# Altium project 2230_TubePitotDeporte_v1.0.0.PrjPcb
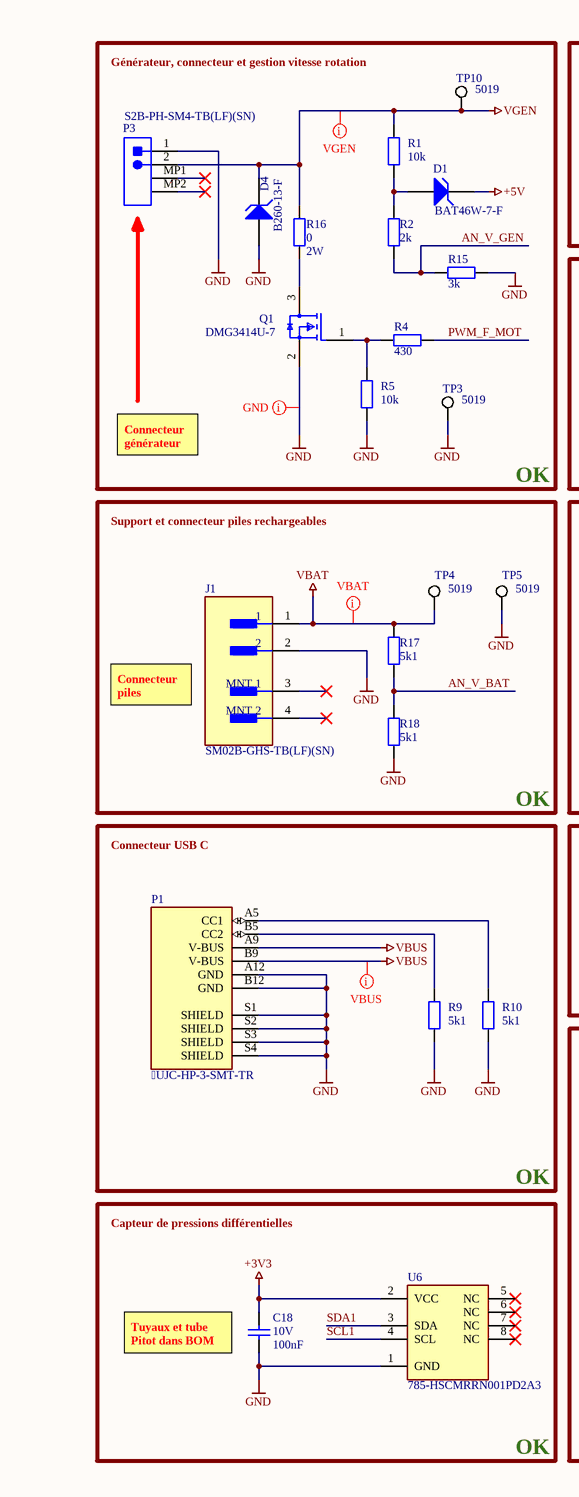
[diagram p0: 2230_TubePitotDeporte_Schematic_v1.0.0.SchDoc, left]
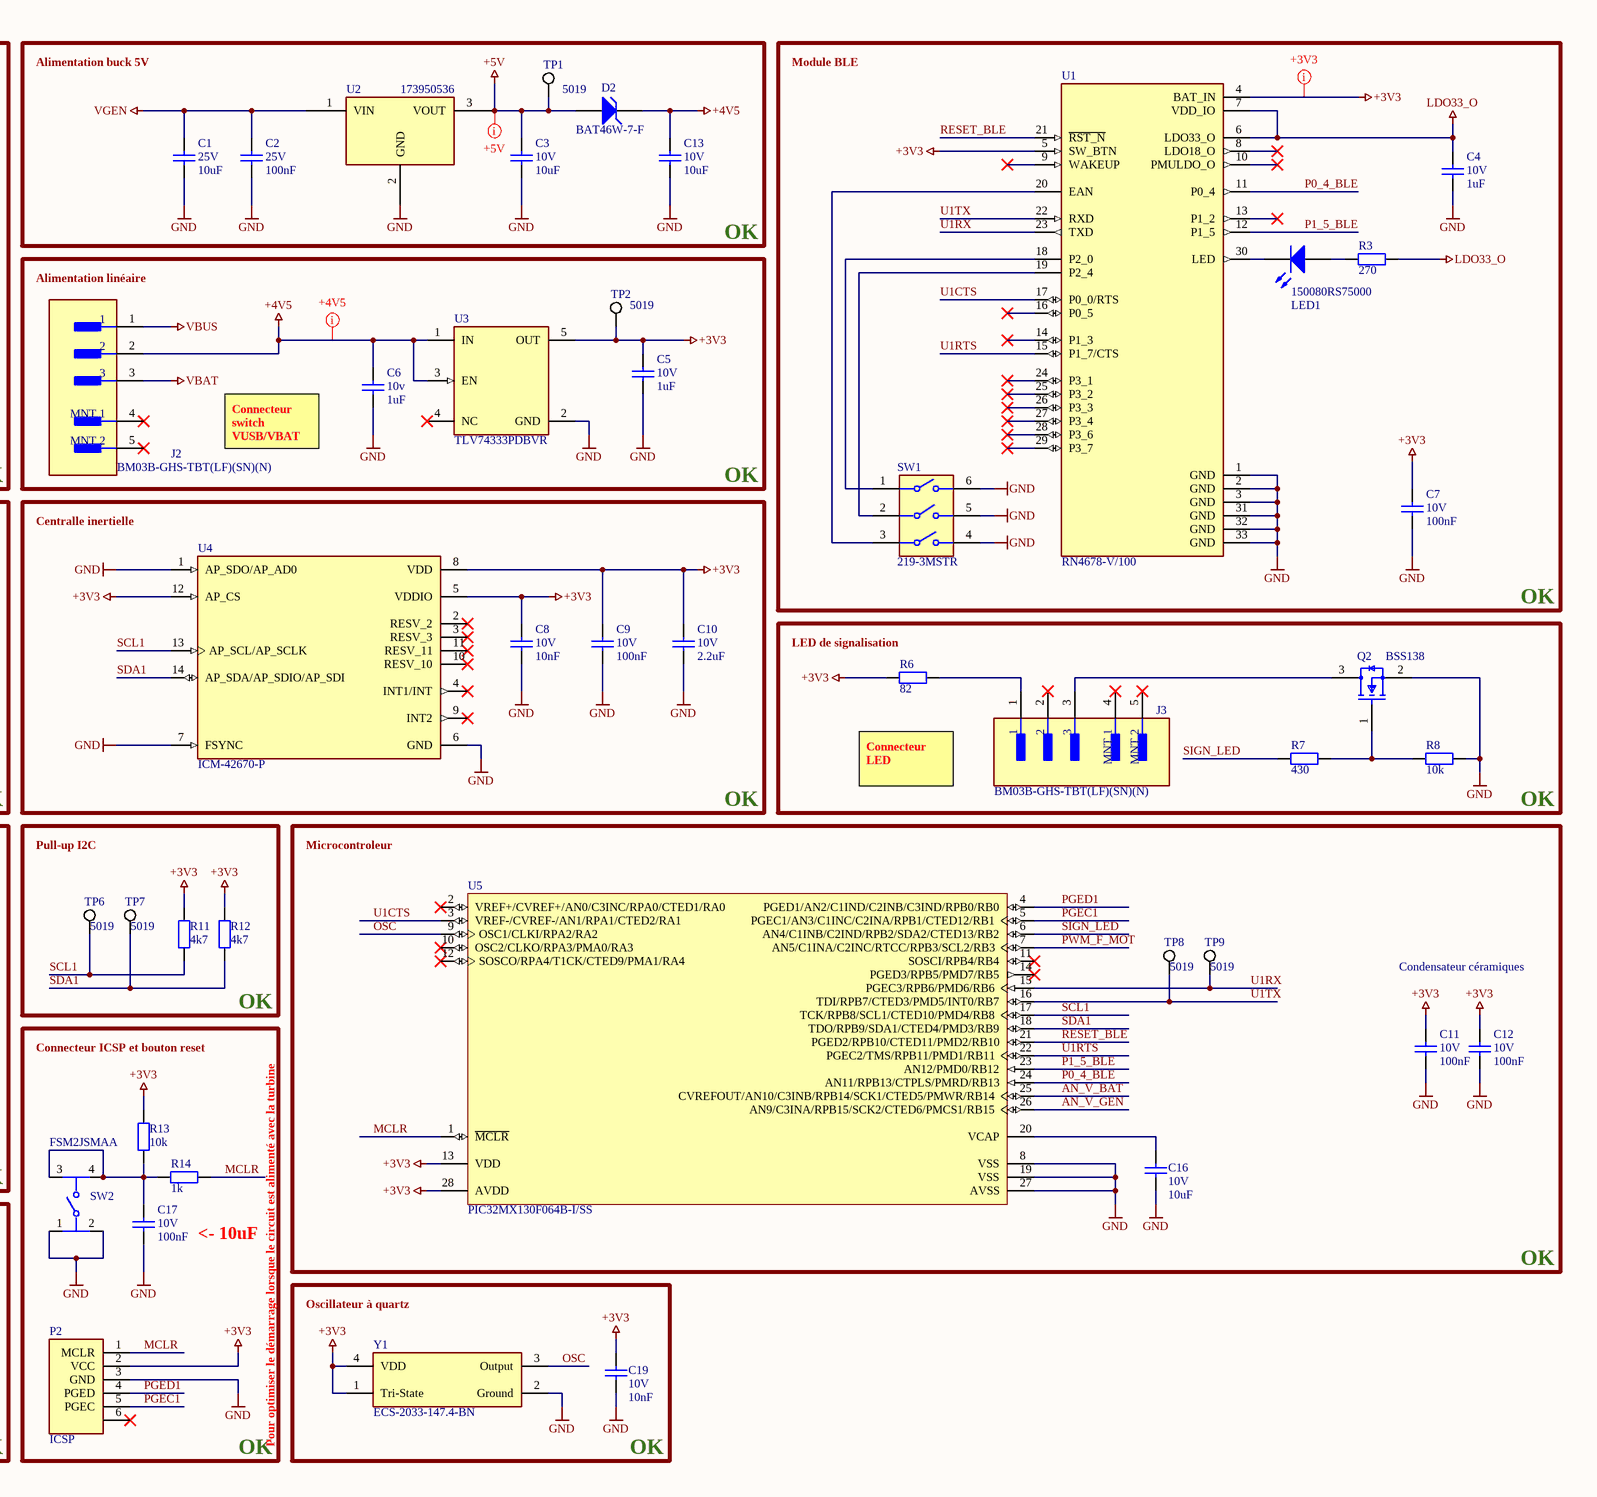
[diagram p1: 2230_TubePitotDeporte_Schematic_v1.0.0.SchDoc, right]
1 sheet, 66 parts. Net scope: global (net labels, ports and power ports of the same name join across sheets).
Board file: 2230_TubePitotDeporte_PCB_v1.0.0.PcbDoc

## Sheet 2230_TubePitotDeporte_Schematic_v1.0.0.SchDoc
size A3; Organization: ETML-ES; Address1: Avenue Recordon 1; Address2: 1004 Lausanne; Address3: Switzerland; SheetNumber: 1; SheetTotal: 1; SPICEModelCacheXRYLVPHF: <root> / <DocumentId>XRYLVPHF</DocumentId> / <CacheFrame Number="0"> / <Model Name="zener" Kind="MDL"> / <Text>*ZENER / *Default Zener 10V @ 10mA / *Zener Diode Pinout: A,K / .MODEL ZENER D( BV=10 IBV=10E-3 )</Text> / </Model> / </CacheFrame> / </root>

### Parts
C1  25V  value 10uF  [0805 CAP T0.95]
C2  25V  value 100nF  [0805 CAP T0.75]
C3  10V  value 10uF  [0805 CAP T0.95]
C4  10V  value 1uF  [0805 CAP T0.75]
C5  10V  value 1uF  [0805 CAP T0.95]
C6  10v  value 1uF  [0805 CAP T0.95]
C7  10V  value 100nF  [0805 CAP T0.75]
C8  10V  value 10nF  [0805 CAP T0.75]
C9  10V  value 100nF  [0805 CAP T0.75]
C10  10V  value 2.2uF  [0805 CAP T0.75]
C11  10V  value 100nF  [0805 CAP T0.75]
C12  10V  value 100nF  [0805 CAP T0.75]
C13  10V  value 10uF  [0805 CAP T0.95]
C16  10V  value 10uF  [0805 CAP T0.95]
C17  10V  value 100nF  [0805 CAP T0.75]
C18  10V  value 100nF  [0805 CAP T0.75]
C19  10V  value 10nF  [0805 CAP T0.75]
D1  BAT46W-7-F  [SOD123]
D2  BAT46W-7-F  [SOD123]
D4  B260-13-F  [SMB-2]
J1  SM02B-GHS-TB(LF)(SN)  [FP-SM02B-GHS-TB_LF_SN-MFG]
J2  BM03B-GHS-TBT(LF)(SN)(N)  [FP-BM03B-GHS-TBT_LF_SN-MFG]
J3  BM03B-GHS-TBT(LF)(SN)(N)  [FP-BM03B-GHS-TBT_LF_SN-MFG]
LED1  150080RS75000  [0805_A]
P1  UJC-HP-3-SMT-TR  [UJC-HP-3-SMT-TR]
P2  ICSP  [ICSP]
P3  S2B-PH-SM4-TB(LF)(SN)  [JST- S2B-PH-SM4-TB(LF)(SN)-2_V]
Q1  DMG3414U-7  [FP-SOT23-IPC_B]
Q2  BSS138  [FP-318-08-IPC_A]
R1  10k  [0805 Res]
R2  2k  [0805 Res]
R3  value 270  [0805 Res]  (hidden comment: 270R)
R4  value 430  [0805 Res]  (hidden comment: 430R)
R5  10k  [0805 Res]
R6  value 82  [0805 Res]  (hidden comment: 82R)
R7  value 430  [0805 Res]  (hidden comment: 430R)
R8  10k  [0805 Res]
R9  5k1  [0805 Res]
R10  5k1  [0805 Res]
R11  value 4k7  [0805 Res]  (hidden comment: 10k)
R12  value 4k7  [0805 Res]  (hidden comment: 10k)
R13  10k  [0805 Res]
R14  1k  [0805 Res]
R15  3k  [0805 Res]
R16  value 0  Power: 2W  [RES 2W]  (hidden comment: 0R)
R17  5k1  [0805 Res]
R18  5k1  [0805 Res]
SW1  219-3MSTR  [FP-219-3MSTR-MFG]
SW2  FSM2JSMAA  [FP-FSM2JSMAA-MFG]
TP1  5019  [KSTN-5019_V]
TP2  5019  [KSTN-5019_V]
TP3  5019  [KSTN-5019_V]
TP4  5019  [KSTN-5019_V]
TP5  5019  [KSTN-5019_V]
TP6  5019  [KSTN-5019_V]
TP7  5019  [KSTN-5019_V]
TP8  5019  [KSTN-5019_V]
TP9  5019  [KSTN-5019_V]
TP10  5019  [KSTN-5019_V]
U1  RN4678-V/100  [RN4678-V_RM100]
U2  173950536  [173950536]
U3  TLV74333PDBVR  [FP-DBV0005A-MFG]
U4  ICM-42670-P  [ICM-42670-P]
U5  PIC32MX130F064B-I/SS  [PIC32MX130F064B-I/SS]
U6  785-HSCMRRN001PD2A3  [HSCMRRN001PD2A3]
Y1  ECS-2033-147.4-BN  [ECS-2033-147.4-BN]

### Blocks framed on the sheet
OK: D1 D4 P3 Q1 R1 R2 R4 R5 R15 R16 TP3 TP10
OK: C1-C3 C13 D2 TP1 U2
OK: C4 C7 LED1 R3 SW1 U1
OK: C5 C6 J2 TP2 U3
OK: C8-C10 U4
OK: R11 R12 TP6 TP7
OK: C17 P2 R13 R14 SW2
OK: C19 Y1

### Nets
+3V3: C5.2 C7.2 C8.2 C9.2 C10.2 C11.2 C12.2 C18.2 C19.1 P2.2(VCC) R6.1 R11.1 R12.1 R13.1 TP2.1 U1.4(BAT_IN) U1.5(SW_BTN) U3.5(OUT) U4.5(VDDIO) U4.8(VDD) U4.12(AP_CS) U5.13(VDD) U5.28(AVDD) U6.2(VCC) Y1.1(Tri-State) Y1.4(VDD)
+4V5: C6.2 C13.2 D2.2(K) J2.2 U3.1(IN) U3.3(EN)
+5V: C3.2 D1.2(K) D2.1(A) TP1.1 U2.3(VOUT)
GND: C1.1 C2.1 C3.1 C4.1 C5.1 C6.1 C7.1 C8.1 C9.1 C10.1 C11.1 C12.1 C13.1 C16.1 C17.1 C18.1 C19.2 D4.1(A) J1.2 P1.A12(GND) P1.B12(GND) P1.S1(SHIELD) P1.S2(SHIELD) P1.S3(SHIELD) P1.S4(SHIELD) P2.3(GND) P3.1 Q1.2(S) Q2.2(S) R5.1 R8.2 R9.1 R10.1 R15.1 R18.2 SW1.4 SW1.5 SW1.6 SW2.1 SW2.2 TP3.1 TP5.1 U1.1(GND) U1.2(GND) U1.3(GND) U1.31(GND) U1.32(GND) U1.33(GND) U2.2(GND) U3.2(GND) U4.1(AP_SDO/AP_AD0) U4.6(GND) U4.7(FSYNC) U5.8(VSS) U5.19(VSS) U5.27(AVSS) U6.1(GND) Y1.2(Ground)
LDO33_O: C4.2 R3.1 U1.6(LDO33_O) U1.7(VDD_IO)
VBAT: J1.1 J2.3 R17.1 TP4.1
VBUS: J2.1 P1.A9(V-BUS) P1.B9(V-BUS)
VGEN: C1.2 C2.2 D4.2(K) P3.2 R1.2 R16.2 TP10.1 U2.1(VIN)
AN_V_BAT: R17.2 R18.1 U5.25(CVREFOUT/AN10/C3INB/RPB14/SCK1/CTED5/PMWR/RB14)
AN_V_GEN: R2.2 R15.2 U5.26(AN9/C3INA/RPB15/SCK2/CTED6/PMCS1/RB15)
MCLR: P2.1(MCLR) R14.1 U5.1(~{MCLR})
OSC: U5.9(OSC1/CLKI/RPA2/RA2) Y1.3(Output)
P0_4_BLE: U1.11(P0_4) U5.24(AN11/RPB13/CTPLS/PMRD/RB13)
P1_5_BLE: U1.12(P1_5) U5.23(AN12/PMD0/RB12)
PGEC1: P2.5(PGEC) U5.5(PGEC1/AN3/C1INC/C2INA/RPB1/CTED12/RB1)
PGED1: P2.4(PGED) U5.4(PGED1/AN2/C1IND/C2INB/C3IND/RPB0/RB0)
PWM_F_MOT: R4.1 U5.7(AN5/C1INA/C2INC/RTCC/RPB3/SCL2/RB3)
RESET_BLE: U1.21(~{RST_N}) U5.21(PGED2/RPB10/CTED11/PMD2/RB10)
SCL1: R11.2 TP6.1 U4.13(AP_SCL/AP_SCLK) U5.17(TCK/RPB8/SCL1/CTED10/PMD4/RB8) U6.4(SCL)
SDA1: R12.2 TP7.1 U4.14(AP_SDA/AP_SDIO/AP_SDI) U5.18(TDO/RPB9/SDA1/CTED4/PMD3/RB9) U6.3(SDA)
SIGN_LED: R7.1 U5.6(AN4/C1INB/C2IND/RPB2/SDA2/CTED13/RB2)
U1CTS: U1.17(P0_0/RTS) U5.3(VREF-/CVREF-/AN1/RPA1/CTED2/RA1)
U1RTS: U1.15(P1_7/CTS) U5.22(PGEC2/TMS/RPB11/PMD1/RB11)
U1RX: TP9.1 U1.23(TXD) U5.15(PGEC3/RPB6/PMD6/RB6)
U1TX: TP8.1 U1.22(RXD) U5.16(TDI/RPB7/CTED3/PMD5/INT0/RB7)
NetC16_2: C16.2 U5.20(VCAP)
NetC17_2: C17.2 R13.2 R14.2 SW2.3 SW2.4
NetD1_1: D1.1(A) R1.1 R2.1
NetJ3_1: J3.1 R6.2
NetJ3_3: J3.3 Q2.3(D)
NetLED1_1: LED1.1(K) U1.30(LED)
NetLED1_2: LED1.2(A) R3.2
NetP1_A5: P1.A5(CC1) R10.2
NetP1_B5: P1.B5(CC2) R9.2
NetQ1_1: Q1.1(G) R4.2 R5.2
NetQ1_3: Q1.3(D) R16.1
NetQ2_1: Q2.1(G) R7.2 R8.1
NetSW1_1: SW1.1 U1.18(P2_0)
NetSW1_2: SW1.2 U1.19(P2_4)
NetSW1_3: SW1.3 U1.20(EAN)

Not connected (* = marked no-connect by the designer): J1 3(MNT_1)* 4(MNT_2)*; J2 4(MNT_1)* 5(MNT_2)*; J3 2* 4(MNT_1)* 5(MNT_2)*; P2 6*; P3 MP1* MP2*; U1 8(LDO18_O)* 9(WAKEUP)* 10(PMULDO_O)* 13(P1_2)* 14(P1_3)* 16(P0_5)* 24(P3_1)* 25(P3_2)* 26(P3_3)* 27(P3_4)* 28(P3_6)* 29(P3_7)*; U3 4(NC)*; U4 2(RESV_2)* 3(RESV_3)* 4(INT1/INT)* 9(INT2)* 10(RESV_10)* 11(RESV_11)*; U5 2(VREF+/CVREF+/AN0/C3INC/RPA0/CTED1/RA0)* 10(OSC2/CLKO/RPA3/PMA0/RA3)* 11(SOSCI/RPB4/RB4)* 12(SOSCO/RPA4/T1CK/CTED9/PMA1/RA4)* 14(PGED3/RPB5/PMD7/RB5)*; U6 5(NC)* 6(NC)* 7(NC)* 8(NC)*

### Layout directives
net class PowerLine: +3V3, +4V5, +5V, GND, VBAT, VBUS, VGEN

### Notes on the sheet
- Générateur, connecteur et gestion vitesse rotation
- Alimentation buck 5V
- Module BLE
- (near J2) Alimentation linéaire
- Connecteur générateur
- Connecteur switch VUSB/VBAT
- Support et connecteur piles rechargeables
- Centralle inertielle
- (near R6) LED de signalisation
- Connecteur piles
- Connecteur LED
- Connecteur USB C
- OK
- Pull-up I2C
- Microcontroleur
- Condensateur céramiques
- Connecteur ICSP et bouton reset
- Capteur de pressions différentielles
- <- 10uF
- Oscillateur à quartz
- (near C18) Tuyaux et tube Pitot dans BOM
- Pour optimiser le démarrage lorsque le circuit est alimenté avec la turbine
- Fichier :
- a
- Date :
- Heure :
- Version :
- Auteur :
- Modif.
- b
- c
- d
- Projet :
- No :
- Nb feuilles
- Feuille n°
- Chemin :

### Library data of the parts
C1-C13 C16-C19 = Cap: Capacitor; Published: 8-Jun-2000; LatestRevisionDate: 17-Jul-2002; LatestRevisionNote: Re-released for DXP Platform.; PackageReference: RAD-0.3; Publisher: Altium Limited; PackageDescription: Radial Cap, Thru-Hole; 2 Leads; 0.3 in Pin Spacing
D1 D2 D4 = D Zener: Zener Diode; Published: 8-Jun-2000; LatestRevisionDate: 17-Jul-2002; LatestRevisionNote: Re-released for DXP Platform.; PackageReference: DIODE-0.7; Publisher: Altium Limited; PackageDescription: Diode, Thru-Hole; 2 Leads; 0.7 in Pin Spacing
J1 = CMP-2000-07076-2: CONN HEADER SMD R/A 2POS 1.25MM; Voltage Rating: 50V; Number of Positions: 2; Pitch: 0.049inch; Current Rating: 1A; Connector Type: Outer Shroud Contact; Number of Rows: 1; Contact Material: Bronze; Termination: Solder; Color: Natural; Package Quantity: 2500; Mount: Surface Mount; Housing Color: Natural; Number of Contacts: 2; Packaging: Tape and Reel; Lead Free: Lead Free; Housing Material: Nylon; Orientation: Right Angle; Contact Type: Male Pin; Contact Plating: Tin; Series: GH; Fastening Type: Latch
J2 J3 = CMP-17439-000058-1: CONN HEADER SMD 3POS 1.25MM; Pitch: 0.049inch; Number of Positions: 3; Contact Finish - Mating: TIN; Lead Free: Lead Free; Series: GH; Fastening Type: Ramp; Number of Rows: 1; Insulation Color: Natural; Contact Material: Bronze; Insulation Material: Nylon; Min Operating Temperature: -25°C; Contact Type: Outer Shroud Contact; Max Operating Temperature: 85°C; Termination: Solder; Flammability Rating: UL94 V-0; Color: Natural; Contact Plating: Tin; Contact Shape: Rectangular; Mount: Surface Mount; Packaging: Cut Tape; Connector Type: Header
LED1 = CMP-1426-00011-1: SMD mono-color Chip LED, WL-SMCW, Red; Manufacturer: Wuerth Elektronik; Color: Red; PartNumber: 150080RS75000; PackageReference: 0805_A; ComponentLink2Description: Datasheet; ComponentLink1URL: http://www.we-online.com; ComponentLink1Description: Manufacturer URL; ComponentLink2URL: http://katalog.we-online.com/led/datasheet/150080RS75000.pdf
P1 = UJC-HP-3-SMT-TR: USBC connector
P2 = ICSP: Prog
P3 = CMP-1755-00001-1: Male Header, Pitch 2 mm, 1 x 2 Position, Height 5.5 mm, -25 to 85 degC, RoHS, Tape and Reel; Current Rating: 3 A; ComponentLink1URL: http://www.jst.com/home2.html; Radiation Hardening: No; RoHSCompliant: True; Mount: Through Hole; Contact Material: Bronze; Package Quantity: 100; Width: 2.34 mm; DatasheetVersion: Dec-12; Height: 8.13 mm; Max Operating Temperature: 105degC; ComponentLink2Description: Datasheet; Lead Pitch: 0.1 inch; Contact Finish: Lead; Packaging: Bulk; Colour: Black; Contact Plating: Tin; Min Operating Temperature: -65degC; ComponentLink1Description: Manufacturer URL; PackageReference: S2B-PH-SM4-TB(LF)(SN)-2; PackageDescription: Male Header, Pitch 2 mm, 1 x 2 Position, Height 5.5 mm; ComponentLink2URL: http://www.jst-mfg.com/product/pdf/eng/ePH.pdf; Pins: 40; Length: 101.19 mm
Q1 = CMP-12801-000101-1: MOSFET N-CH 20V 4.2A SOT23; Rds On Max: 25mR; Input Capacitance: 829.9pF; Rise Time: 8.3ns; Fall Time: 9.6ns; Turn-Off Delay Time: 40.1ns; Element Configuration: Single; Max Power Dissipation: 780mW; Gate to Source Voltage (Vgs): 8V; Number of Elements: 1; Turn-On Delay Time: 8.1ns; Min Operating Temperature: -55°C; Max Operating Temperature: 150°C; Drain to Source Resistance: 25mR; On-State Resistance: 25mR; Height: 1.1mm; Drain to Source Breakdown Voltage: 20V; Lead Free: Lead Free; Case/Package: SOT-23-3; Drain to Source Voltage (Vdss): 20V; Mount: Surface Mount; Length: 3mm; Packaging: Tape and Reel; Continuous Drain Current (ID): 4.2A; Package Quantity: 3000; Weight: 0.000282oz; Number of Pins: 3; REACH SVHC: No SVHC; Number of Channels: 1; Width: 1.4mm; Power Dissipation: 780mW
Q2 = CMP-07173-000101-1: MOSFET N-CH 50V 220MA SOT-23; Turn-Off Delay Time: 20ns; Element Configuration: Single; Rds On Max: 3.5R; Gate to Source Voltage (Vgs): 20V; Threshold Voltage: 1.3V; Number of Elements: 1; Power Dissipation: 360mW; Rise Time: 9ns; Turn-On Delay Time: 2.5ns; Input Capacitance: 27pF; On-State Resistance: 6R; Lead Free: Lead Free; Length: 2.92mm; Width: 1.3mm; Drain to Source Breakdown Voltage: 50V; Min Operating Temperature: -55°C; REACH SVHC: No SVHC; Packaging: Tape and Reel; Radiation Hardening: No; Height: 0.93mm; Drain to Source Voltage (Vdss): 50V; Current Rating: 220mA; Voltage Rating (DC): 50V; Weight: 0.03g; Continuous Drain Current (ID): 220mA; Number of Pins: 3; Nominal Vgs: 1.3V; Max Power Dissipation: 360mW; Fall Time: 9ns; Drain to Source Resistance: 3.5R; Contact Plating: Tin; Case/Package: SOT-23; Package Quantity: 1; Dual Supply Voltage: 50V; Mount: Surface Mount; Termination: SMD/SMT; Max Operating Temperature: 150°C
R1-R18 = Res2: Resistor; Published: 8-Jun-2000; LatestRevisionDate: 17-Jul-2002; LatestRevisionNote: Re-released for DXP Platform.; PackageReference: AXIAL-0.4; Publisher: Altium Limited; PackageDescription: Axial Device, Thru-Hole; 2 Leads; 0.4 in Pin Spacing
  R1 R5 R8 R13: Value: 10k
  R2: Value: 2k
  R9 R10 R17 R18: Value: 5k1
  R14: Value: 1k
  R15: Value: 3k
SW1 = CMP-07018-000004-1: SWITCH SLIDE DIP SPST 100MA 20V; Washable: Yes; Mechanical Life: 2000Cycles; Number of Positions: 3; Pitch: 0.1inch; Actuator Type: Slide (Standard); Max Operating Temperature: 85°C; Voltage Rating (DC): 20V; Termination: Gull Wing; Length: 0.358inch; Min Operating Temperature: -55°C; Orientation: Straight; Mount: Surface Mount; Package Quantity: 1000; Current Rating: 100mA; Electrical Life: 2000Cycles; Max Current Rating: 100mA; Throw Configuration: SPST; Contact Material: Copper; Packaging: Tape and Reel; Contact Plating: Gold; Lead Free: Lead Free; Max Voltage Rating (DC): 20V
SW2 = CMP-03402-000003-1: SWITCH TACTILE SPST-NO 0.05A 24V; Manufacturer: TE Connectivity; Standoff Height: 0.05mm; Contact Current Rating: 50mA; Electromechanical Life: 100000Cycles; Operating Force: 260gf; Contact Resistance: 100mΩ; Package: 0; Temperature Range High: +85°C; Temperature: -35°C to +85°C; Category: Switch; Manufacturer Part Number: FSM2JSMAA; RoHS: TRUE; Mouser Description: Tactile Switches TACTILE 260G FORCE S; Device Class L1: Electromechanical; Mount: Surface Mount; Height: 4.59mm; ComponentLink2URL: https://www.te.com/commerce/DocumentDelivery/DDEController?Action=showdoc&DocId=Customer+Drawing%7F2-1437565-7%7FV%7Fpdf%7FEnglish%7FENG_CD_2-1437565-7_V.pdf%7F2-1437565-8; Temperature Range Low: -35°C; Voltage Rating Dc: 24V; Lead Free: Yes; Automotive: No; Throw Configuration: SPST-NO; Octopart: https://octopart.com/fsm2jsmaa-te+connectivity-41720620; Device Class L2: Switches; Device Class L3: Pushbutton Switches; ComponentLink2Description: Datasheet; Digikey Description: SWITCH TACTILE SPST-NO 0.05A 24V
TP1-TP10 = CMP-1672-00008-1: Test Point, 1 Position SMD, RoHS, Tape and Reel; ComponentLink1Description: Manufacturer URL; Package Quantity: 1000; DatasheetVersion: 03/2014; Packaging: Tape and Reel; ComponentLink2URL: http://www.keyelco.com/product-pdf.cfm?p=1357; ComponentLink1URL: http://www.keyelco.com/; Mount: Surface Mount; Contact Plating: Silver; PackageDescription: 1-Pin Surface Mount Device, Body 3.81 x 2.03 mm; Pins: 1; RoHSCompliant: True; Mounting Technology: Surface Mount; ComponentLink2Description: Datasheet; PackageReference: 5019
U1 = RN4678-V/100: Bluetooth Bluetooth v5.0 Transceiver Module 2.4GHz Integrated, Chip Surface Mount
U2 = 710-173950536: Buck 5V
U3 = CMP-04917-000051-1: IC REG LINEAR 3.3V 300MA SOT23-5; Manufacturer: Texas Instruments; Dropout Voltage: 125mV; Output Type: Fixed; Min Supply Voltage: 1.4V; Max Supply Voltage: 5.5V; Output Voltage: 1-3.3V; Standoff Height: 0mm; Nominal Supply Current: 34uA; Number Of Outputs: 1; Accuracy Percentage: 1%; Max Junction Temp: +125°C; Mouser Description: 300mA Low-Dropout (LDO) Regulator 5-SOT-23 -40 to 125; Device Class L1: Integrated Circuits (ICs); Temperature Range High: +125°C; Octopart: https://octopart.com/tlv74333pdbvr-texas+instruments-84791760; Device Class L3: Voltage Regulators - Linear; Height: 1.45mm; Category: IC; Temperature Range Low: -40°C; Output Current: 300mA; RoHS: TRUE; Automotive: No; Manufacturer Part Number: TLV74333PDBVR; Digikey Description: IC REG LINEAR 3.3V 300MA SOT23-5; Package: DBV0005A; Temperature: -40°C to +125°C; ComponentLink2URL: http://www.ti.com/lit/ds/symlink/tlv743p.pdf; Lead Free: Yes; Device Class L2: Power Management ICs; ComponentLink2Description: Datasheet
U4 = ICM-42670-P: 6 axis IMU
U6 = 785-HSCMRRN001PD2A3: Air sensor
Y1 = ECS-2033-147.4-BN: ECS-2033-147.4-BN 14.7456 MHz Oscillator